# Altium schematic sheet humidityDetector.SchDoc
size 420 x 297 mm; SheetNumber: 1; SheetTotal: 1; DocumentName: Sheet1.SCHDOC
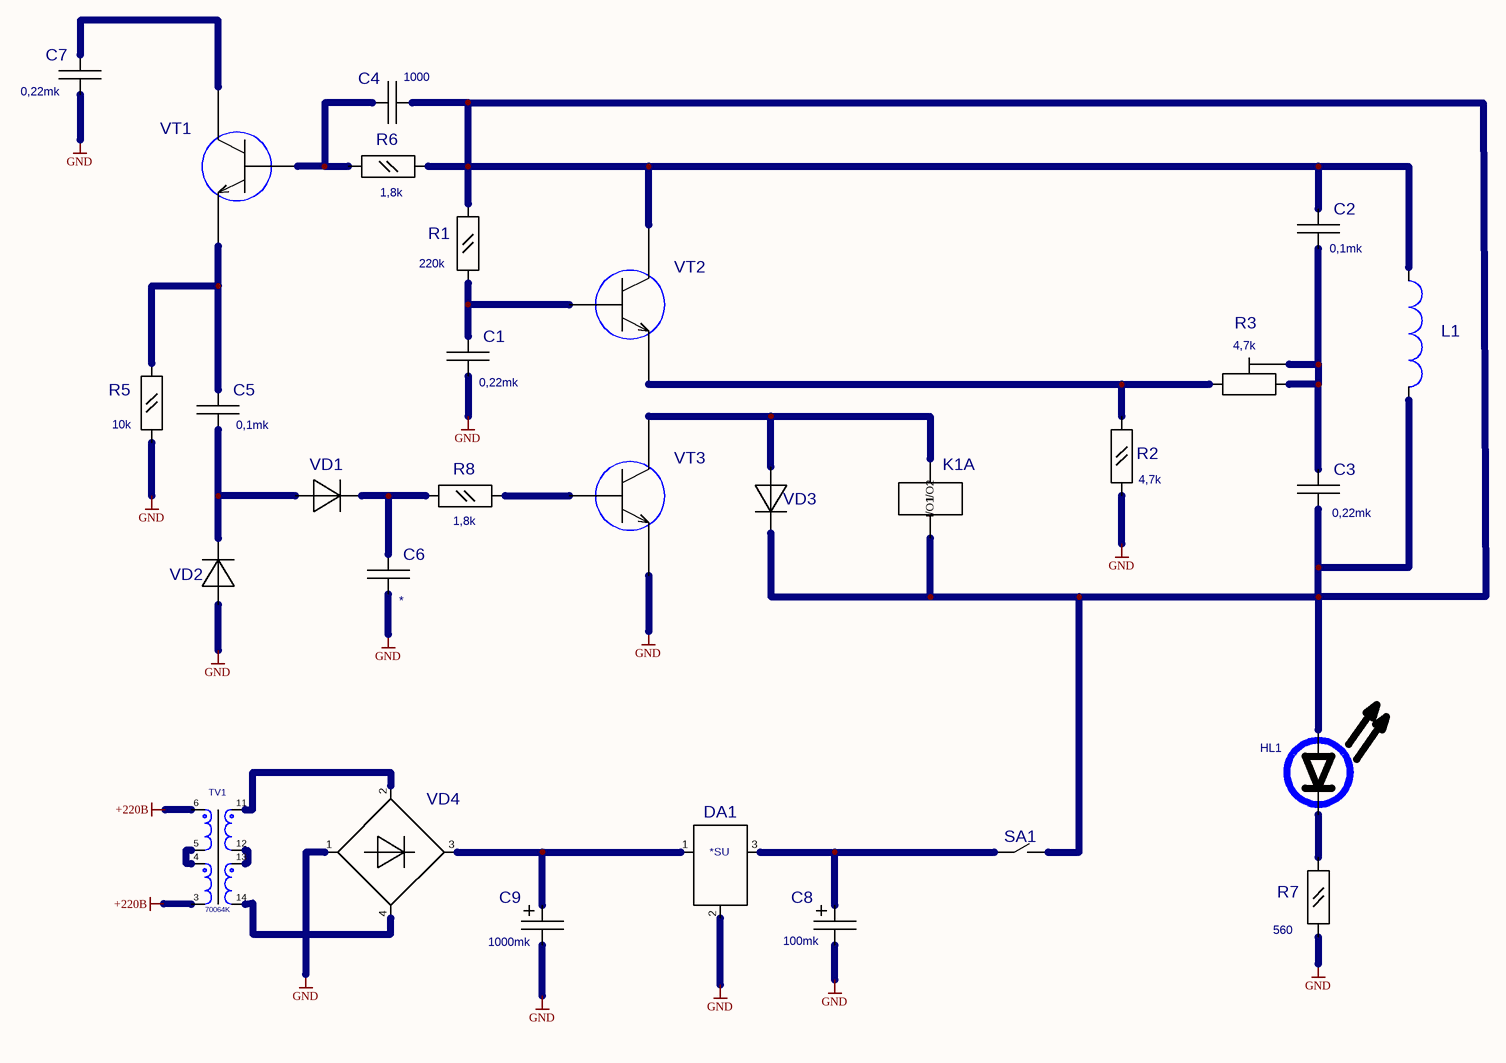
[diagram p0: humidityDetector.SchDoc]

## Parts
C1  value 0,22mk  [CC2220]  (hidden comment: CC2220)
C2  value 0,1mk  [CC2220]  (hidden comment: CC2220)
C3  value 0,22mk  [CC2220]  (hidden comment: CC2220)
C4  value 1000  [CC2220]  (hidden comment: CC2220)
C5  value 0,1mk  [CC2220]  (hidden comment: CC2220)
C6  CC2220  [CC2220]  (value not drawn)
C7  value 0,22mk  [CC2220]  (hidden comment: CC2220)
C8  value 100mk  [K534A-1]  (hidden comment: K534A-1)
C9  value 1000mk  [K534A-1]  (hidden comment: K534A-1)
DA1  КР1158ЕН5  [KT26-3]  (value not drawn)
HL1  АЛЗ07Б  [АЛЗ07Б]  (value not drawn)
K1  РЭК53  [REK53]  (value not drawn)  (part A of 3)
L1  1812CS-472XJL  [1812CS]  (value not drawn)
R1  value 220k  [C2-33H-0.125W]  (hidden comment: C2-33H-0.125W_OLD_UGO)
R2  value 4,7k  [C2-33H-0.125W]  (hidden comment: C2-33H-0.125W_OLD_UGO)
R3  value 4,7k  [16K1]  (hidden comment: 16K1)
R5  value 10k  [C2-33H-0.125W]  (hidden comment: C2-33H-0.125W_OLD_UGO)
R6  value 1,8k  [C2-33H-0.125W]  (hidden comment: C2-33H-0.125W_OLD_UGO)
R7  value 560  [C2-33H-0.125W]  (hidden comment: C2-33H-0.125W_OLD_UGO)
R8  value 1,8k  [C2-33H-0.125W]  (hidden comment: C2-33H-0.125W_OLD_UGO)
SA1  8AS9M2RE  [8AS9M2RE]  (value not drawn)
TV1  70064K  [70000_72400_SERIES]
VD1  KD522  [VDD10]  (value not drawn)
VD2  KD522  [VDD10]  (value not drawn)
VD3  KD522  [VDD10]  (value not drawn)
VD4  KC412  [KC412]  (value not drawn)
VT1  КТ312  [КТ312]  (value not drawn)
VT2  КТ312  [КТ312]  (value not drawn)
VT3  КТ312  [КТ312]  (value not drawn)

## Nets
+220B: TV1.3 TV1.6
GND: C1.2 C6.2 C7.2 C8.2(I/OB) C9.2(I/OB) DA1.2(GND0) R2.1 R5.2 R7.2 VD2.2(I/O2) VD4.1(I/O1) VT3.E
NetC1_1: C1.1 R1.2 VT2.B
NetC2_1: C2.1 C3.2 C4.2 HL1.0 K1.1(I/O1) L1.1 L1.2 R1.1 R6.1 SA1.1 VD3.1(I/O1) VT2.K
NetC2_2: C2.2 C3.1 R3.2 R3.3
NetC4_1: C4.1 R6.2 VT1.B
NetC5_1: C5.1 R5.1 VT1.E
NetC5_2: C5.2 VD1.2(I/O2) VD2.1(I/O1)
NetC6_1: C6.1 R8.2 VD1.1(I/O1)
NetC7_1: C7.1 VT1.K
NetC8_1: C8.1(I/OA) DA1.3(OUT0) SA1.2
NetC9_1: C9.1(I/OA) DA1.1(IN0) VD4.3(I/O3)
NetHL1_1: HL1.1 R7.1
NetK1_2: K1.2(I/O2) VD3.2(I/O2) VT3.K
NetR2_2: R2.2 R3.1 VT2.E
NetR8_1: R8.1 VT3.B
NetTV1_4: TV1.4 TV1.5
NetTV1_11: TV1.11 VD4.2(I/O2)
NetTV1_12: TV1.12 TV1.13
NetTV1_14: TV1.14 VD4.4(I/O4)

Not connected (* = marked no-connect by the designer): TV1 1 2 7 8 9 10 15 16 17 18 19 20 21 22 23 24 25 26 27 28 29 30 31 32 33 34 35

## Notes on the sheet
- (in symbol КР1158ЕН5) *SU

## Library data of the parts
C8 C9 = K534A-1: PDIF_TY: 11245
L1 = 1812CS-472XJL: Inductor; Value: 4.7u; ComponentField6: Published 8-Jun-2000; OriginalName: INDUCTOR
R1 R2 R5-R8 = C2-33H-0.125W_OLD_UGO: Autor: pcbdesigner.ru
C1-C7 = CC2220
  C6: Value: *
DA1 = КР1158ЕН5: Value: *
HL1 = АЛЗ07Б: Value: *
K1 = РЭК53: Value: *
SA1 = 8AS9M2RE: Value: *; Author: pcbdesigner.ru
TV1 = 70064K: Value: *
VD1-VD3 = KD522: Value: *
VD4 = KC412: Value: *
VT1-VT3 = КТ312: Value: *